# EAGLE design half-pint-turbidimeter_led (EAGLE 7.3.0)
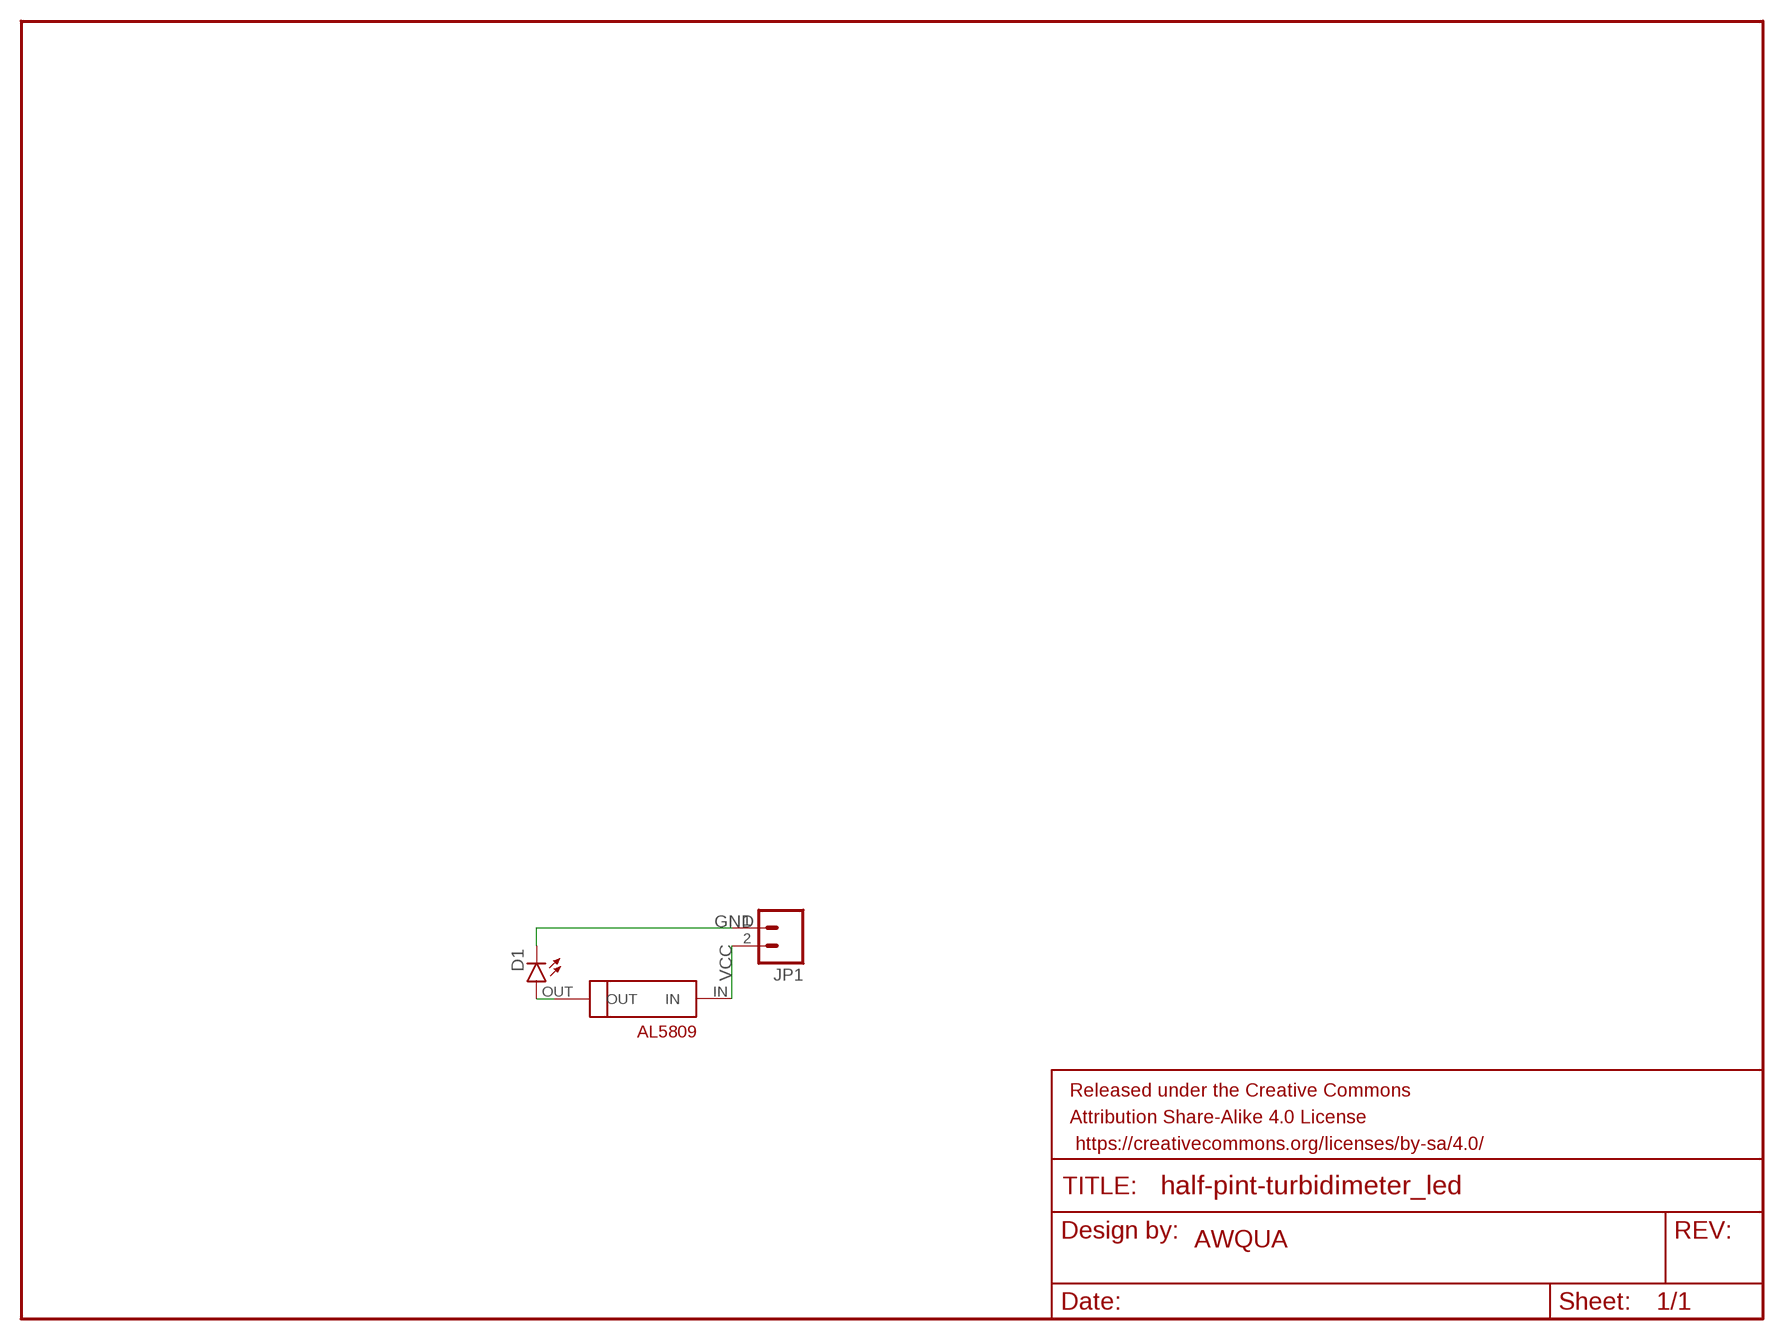
[diagram p0: schematic, sheet 1]

## Parts
D1  LED5MM  [LED5MM]
FRAME1  FRAME-LETTER  [CREATIVE_COMMONS]
JP1  M021X02_NO_SILK  [1X02_NO_SILK]
U$1  AL5809  [AL5809]

## Nets
$N1: D1.A U$1.OUT
GND: D1.K(C) JP1.1
VCC: JP1.2 U$1.IN

## Notes on the sheet
- AWQUA

## Library data of the parts
D1 = SparkFun-LED:LED: LEDs Standard schematic elements and footprints for 5mm, 3mm, 1206, and 0603 sized LEDs. 5mm - Spark Fun Electronics SKU : COM-00529 (and others)
FRAME1 = SparkFun-Aesthetics:FRAME-LETTER: Schematic Frame Standard 8.5x11 US Letter frame
JP1 = SparkFun-Connectors:M02: Standard 2-pin 0.1" header. Use with - straight break away headers ( PRT-00116) - right angle break away headers (PRT-00553) - swiss pins (PRT-00743) - machine pins (PRT-00117) - female headers (PRT-00115) Molex polarized connector foot print use with: PRT-08233 with associated crimp pins and housings. 2.54_SCREWTERM for use with PRT-10571. 3.5mm Screw Terminal footprints for PRT-08084 5mm Screw Terminal footprints for use with PRT-08432
U$1 = awqua_eagle_library:AL5809

## Board
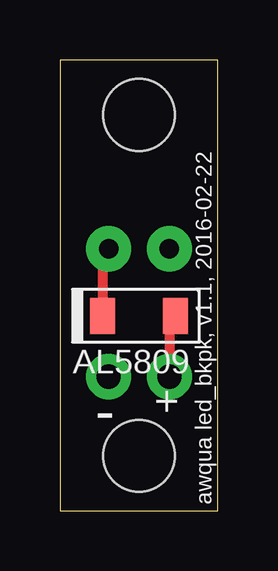
[diagram p1: board, top side]
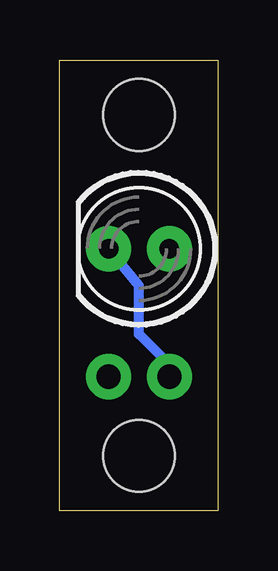
[diagram p2: board, bottom side, seen from below]

Size 6.6 x 18.8 mm. Coordinates in mm from the lower left corner, seen from the top.
Outline: 0,0 6.6,0 6.6,18.8 0,18.8 0,0
Copper layers (1*16): Top 0.035mm / dielectric 1.5mm / Bottom 0.035mm
Design rules "default": minimum track width 10mil, minimum drill 24mil, track to track 8mil, track to pad 8mil, pad to pad 8mil, via to via 8mil, smd to smd 8mil, copper to edge 40mil, drill to drill 8mil, minimum pad ring 10mil, minimum via ring 8mil, stop-mask expansion 4mil, vias tented up to drill 0mil, thermal gap 10mil
Holes 3 mm at 3.3,16.51 3.3,2.29

### Footprints (pad centres in the part's own frame; a part is rotated, then mirrored left to right if it is on the bottom)
LED5MM = drill 0.813 pad 1.88: A -1.27,0; K 1.27,0
1X02_NO_SILK = drill 1.016 pad 1.88: 1 0,0; 2 2.54,0
AL5809 = smd 1.05 x 1.5: IN 0,0; OUT 3.05,0

### Placement (x,y rotation side)
D1  3.3,10.92 180 bottom
JP1  2.03,5.59 0 top
U$1  4.83,8.13 180 top
U$2  [CREATIVE_COMMONS]  -14.99,-8.13 0 top  (outside the outline)

### Tracks (layer width: path | path; a pad name or v marks a point on that pad's centre or on a via)
$N1
  Top 0.406: D1.A 1.78,10.67 U$1.OUT
GND
  Bottom 0.406: JP1.1 2.03,6.1 3.3,7.37 3.3,9.4 D1.K
VCC
  Top 0.406: U$1.IN 4.57,8.13 JP1.2

### Text on the board
tPlace: - | + | awqua led_bkpk, v1.1, 2016-02-22
tNames: AWQUA